# EAGLE design breakout0 (EAGLE 5.11)
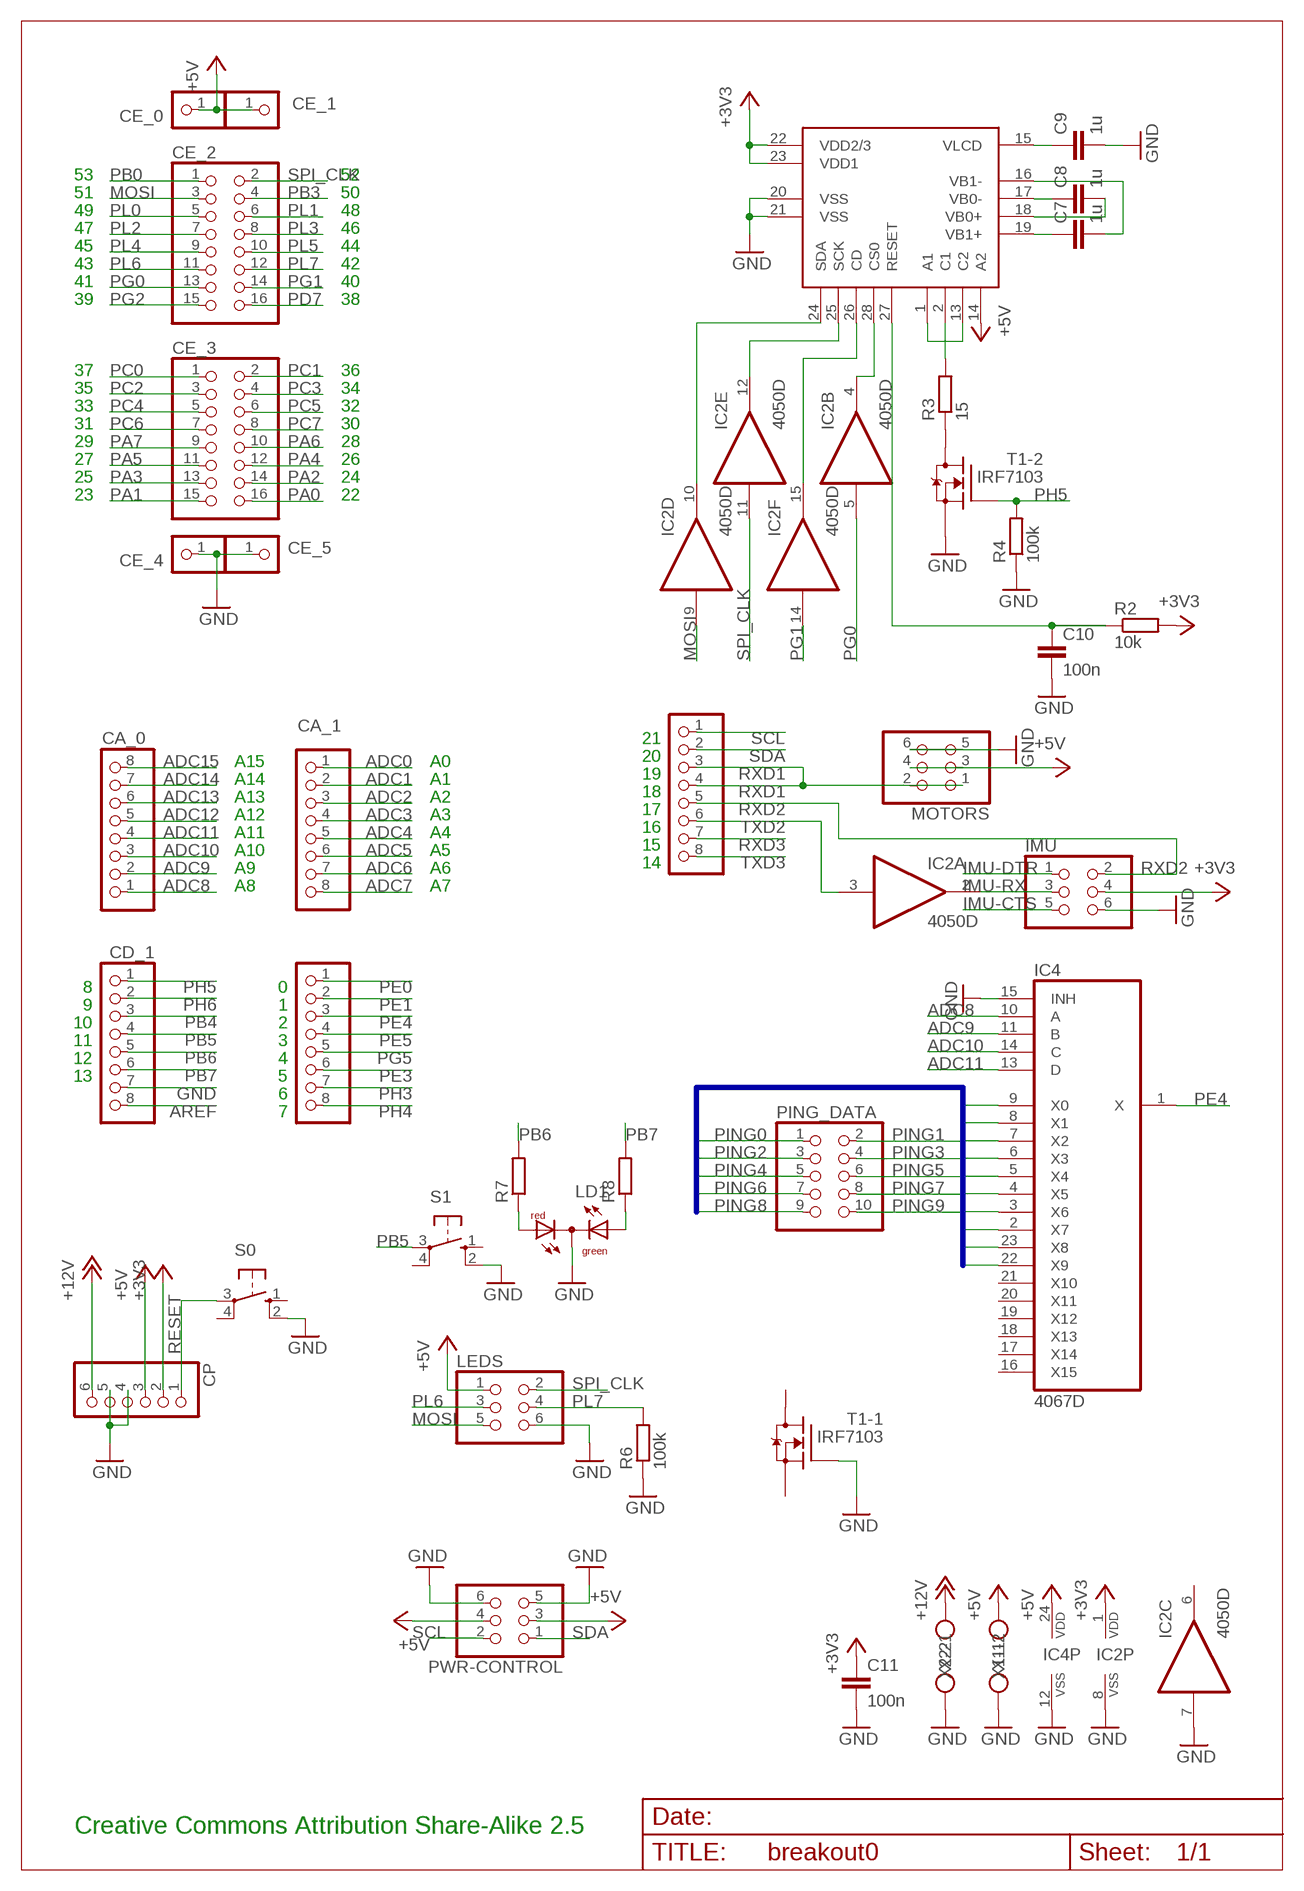
[diagram p0: schematic, sheet 1]

## Parts
C7  1u  C-EUC0805K  [C0805K]
C8  1u  C-EUC0805K  [C0805K]
C9  1u  C-EUC0805K  [C0805K]
C10  100n  C-EUC0805K  [C0805K]
C11  100n  C-EUC0805K  [C0805K]
CA_0  PINHD-1X8  [1X08]
CA_1  PINHD-1X8  [1X08]
CC  PINHD-1X8  [1X08]
CD_0  PINHD-1X8  [1X08]
CD_1  PINHD-1X8  [1X08]
CE_0  PINHD-1X1  [1X01]
CE_1  PINHD-1X1  [1X01]
CE_2  PINHD-2X8  [2X08]
CE_3  PINHD-2X8  [2X08]
CE_4  PINHD-1X1  [1X01]
CE_5  PINHD-1X1  [1X01]
CP  PINHD-1X6  [1X06]
IC2  4050D  [SO16]
IC3  DOGS 102  DOGS102  [DOGS102]
IC4  4067D  [SO24W]
IMU  PINHD-2X3  [2X03]
LD1  DUOLED-RG-C  [DUOLED-C-5MM]
LEDS  PINHD-2X3  [2X03]
MOTORS  PINHD-2X3  [2X03]
PING_DATA  PINHD-2X5  [2X05]
PWR-CONTROL  PINHD-2X3  [2X03]
R2  10k  R-EU_M0805  [M0805]
R3  15  R-EU_M0805  [M0805]
R4  100k  R-EU_M0805  [M0805]
R6  100k  R-EU_M0805  [M0805]
R7  R-EU_M0805  [M0805]
R8  R-EU_M0805  [M0805]
S0  10-XX  [B3F-10XX]
S1  10-XX  [B3F-10XX]
T1  IRF7103  [SO-8]
X1  MKDSN1,5/2-5,08  [MKDSN1,5/2-5,08]
X2  MKDSN1,5/2-5,08  [MKDSN1,5/2-5,08]

## Nets
+3V3: C11.1 CP.2 IC2.1(P:VDD) IC3.22(VDD2/3) IC3.23(VDD1) IMU.4 R2.2
+5V [power]: CE_0.1 CE_1.1 CP.3 IC3.14(A2) IC4.24(VDD) LEDS.1 MOTORS.3 MOTORS.4 PWR-CONTROL.3 PWR-CONTROL.4 X1.1
+12V: CP.6 X2.2
ADC0: CA_1.1
ADC1: CA_1.2
ADC2: CA_1.3
ADC3: CA_1.4
ADC4: CA_1.5
ADC5: CA_1.6
ADC6: CA_1.7
ADC7: CA_1.8
ADC8: CA_0.1 IC4.10(A)
ADC9: CA_0.2 IC4.11(B)
ADC10: CA_0.3 IC4.14(C)
ADC11: CA_0.4 IC4.13(D)
ADC12: CA_0.5
ADC13: CA_0.6
ADC14: CA_0.7
ADC15: CA_0.8
AREF: CD_1.8
GND [gnd]: C9.2 C10.2 C11.2 CD_1.7 CE_4.1 CE_5.1 CP.4 CP.5 IC2.7(C:I) IC2.8(P:VSS) IC3.20(VSS) IC3.21(VSS) IC4.12(VSS) IC4.15(INH) IMU.6 LD1.C LEDS.6 MOTORS.5 MOTORS.6 PWR-CONTROL.5 PWR-CONTROL.6 R4.1 R6.1 S0.2(S1) S1.2(S1) T1.2(-1:G) T1.3(-2:S) X1.2 X2.1
IMU-CTS: IMU.5
IMU-DTR: IMU.1
IMU-RX: IC2.2(A:O) IMU.3
LCD_CD: IC2.15(F:O) IC3.26(CD)
LCD_CS0: IC2.4(B:O) IC3.28(CS0)
LCD_RESET: C10.1 IC3.27(RESET) R2.1
LCD_SCK: IC2.12(E:O) IC3.25(SCK)
LCD_SDA: IC2.10(D:O) IC3.24(SDA)
MOSI: CE_2.3 IC2.9(D:I) LEDS.5
N$1: R3.1 T1.5(-2:D1)
N$4: LD1.AR R7.1
N$5: LD1.AX(AG) R8.1
N$13: IC3.1(A1) IC3.13(C2)
N$14: IC3.2(C1) R3.2
N$17: C8.1 IC3.17(VB0-)
N$18: C8.2 IC3.18(VB0+)
N$19: C7.1 IC3.19(VB1+)
N$20: C7.2 IC3.16(VB1-)
N$21: C9.1 IC3.15(VLCD)
PA0: CE_3.16
PA1: CE_3.15
PA2: CE_3.14
PA3: CE_3.13
PA4: CE_3.12
PA5: CE_3.11
PA6: CE_3.10
PA7: CE_3.9
PB0: CE_2.1
PB3: CE_2.4
PB4: CD_1.3
PB5: CD_1.4 S1.3(P)
PB6: CD_1.5 R7.2
PB7: CD_1.6 R8.2
PC0: CE_3.1
PC1: CE_3.2
PC2: CE_3.3
PC3: CE_3.4
PC4: CE_3.5
PC5: CE_3.6
PC6: CE_3.7
PC7: CE_3.8
PD7: CE_2.16
PE0: CD_0.1
PE1: CD_0.2
PE3: CD_0.6
PE4: CD_0.3 IC4.1(X)
PE5: CD_0.4
PG0: CE_2.13 IC2.5(B:I)
PG1: CE_2.14 IC2.14(F:I)
PG2: CE_2.15
PG5: CD_0.5
PH3: CD_0.7
PH4: CD_0.8
PH5: CD_1.1 R4.2 T1.4(-2:G)
PH6: CD_1.2
PING0: IC4.9(X0) PING_DATA.1
PING1: IC4.8(X1) PING_DATA.2
PING2: IC4.7(X2) PING_DATA.3
PING3: IC4.6(X3) PING_DATA.4
PING4: IC4.5(X4) PING_DATA.5
PING5: IC4.4(X5) PING_DATA.6
PING6: IC4.3(X6) PING_DATA.7
PING7: IC4.2(X7) PING_DATA.8
PING8: IC4.23(X8) PING_DATA.9
PING9: IC4.22(X9) PING_DATA.10
PL0: CE_2.5
PL1: CE_2.6
PL2: CE_2.7
PL3: CE_2.8
PL4: CE_2.9
PL5: CE_2.10
PL6: CE_2.11 LEDS.3
PL7: CE_2.12 LEDS.4 R6.2
RESET: CP.1 S0.3(P)
RXD1: CC.3 CC.4 MOTORS.1 MOTORS.2
RXD2: CC.5 IMU.2
RXD3: CC.7
SCL: CC.1 PWR-CONTROL.2
SDA: CC.2 PWR-CONTROL.1
SPI_CLK: CE_2.2 IC2.11(E:I) LEDS.2
TXD2: CC.6 IC2.3(A:I)
TXD3: CC.8
Unconnected: IC2.6(C:O) IC4.16(X15) IC4.17(X14) IC4.18(X13) IC4.19(X12) IC4.20(X11) IC4.21(X10) S0.1(S) S0.4(P1) S1.1(S) S1.4(P1) T1.1(-1:S) T1.6(-2:D) T1.7(-1:D1) T1.8(-1:D)

## Buses
PING[0..9]

## Notes on the sheet
- 53 | 52
- 51 | 50
- 49 | 48
- 47 | 46
- 45 | 44
- 43 | 42
- 41 | 40
- 39 | 38
- 37 | 36
- 35 | 34
- 33 | 32
- 31 | 30
- 29 | 28
- 27 | 26
- 25 | 24
- 23 | 22
- 21
- 20
- A15 | A0 | 19
- A14 | A1 | 18
- A13 | A2 | 17
- A12 | A3 | 16
- A11 | A4 | 15
- A10 | A5 | 14
- A9 | A6
- A8 | A7
- 8 | 0
- 9 | 1
- 10 | 2
- 11 | 3
- 12 | 4
- 13 | 5
- 6
- 7
- Creative Commons Attribution Share-Alike 2.5

## Library data of the parts
C7-C11 = rcl:C-EU: CAPACITOR, European symbol
CA_0 CA_1 CC CD_0 CD_1 = pinhead:PINHD-1X8: PIN HEADER
CE_0 CE_1 CE_4 CE_5 = pinhead:PINHD-1X1: PIN HEADER
CE_2 CE_3 = pinhead:PINHD-2X8: PIN HEADER
CP = pinhead:PINHD-1X6: PIN HEADER
IC2 = 40xx:4050: Hex non-inverting BUFFER
IC3 = DOGS102:DOGS102: DOGS102-6 GRAFIK 102x64 39x41 mm LED-BELEUCHTUNG WEISS, EA LED39X41-W LED-BELEUCHTUNG AMBER, EA LED39X41-A LED-BELEUCHTUNG GR/ROT , EA LED39X41-GR
IC4 = 40xx:4067: 16-channel ANALOG MULTIPLEXER
IMU LEDS MOTORS PWR-CONTROL = pinhead:PINHD-2X3: PIN HEADER
LD1 = led:DUOLED-RG-C: DUO LED 2 colors (red/green), 5 mm, round, common Cathode www.ligitek.com or other producers.
PING_DATA = pinhead:PINHD-2X5: PIN HEADER
R2 R3 R7 R8 = rcl:R-EU_: RESISTOR, European symbol
R4 R6 = resistor:R-EU_: RESISTOR, European symbol
S0 S1 = switch-omron:10-XX: OMRON SWITCH
T1 = transistor-fet:IRF7103: Dual N-Channel MOSFET
X1 X2 = con-phoenix-508:MKDSN1,5/2-5,08: MKDSN 1,5/ 2-5,08 Printklemme Nennstrom: 13,5 A Nennspannung: 250 V Rastermaß: 5,08 mm Polzahl: 2 Anschlussart: Schraubanschluss Montage: Löten Anschlussrichtung Leiter/Platine: 0 ° Artikelnummer: 1729128 Source: http://eshop.phoenixcontact.com .. 1729128.pdf

## Net classes
0 default: width 0.203 mm, drill 0.406 mm, clearance 0.203 mm
1 power: width 0.61 mm, drill 0.711 mm, clearance 0.203 mm
2 gnd: width 0.305 mm, drill 0.711 mm, clearance 0.203 mm
3 usbvcc: width 0.508 mm, drill 0.711 mm, clearance 0.203 mm

## Board
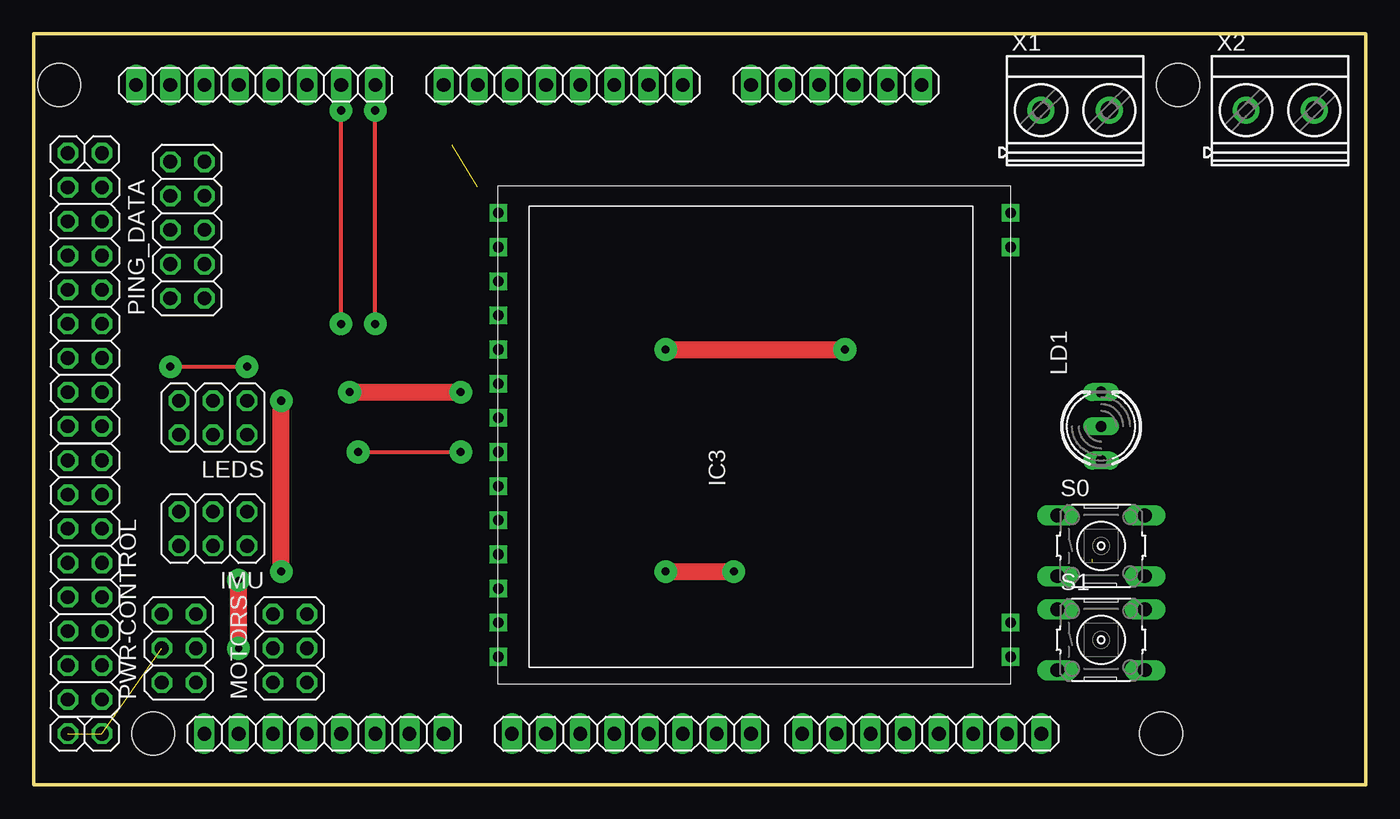
[diagram p1: board, top side]
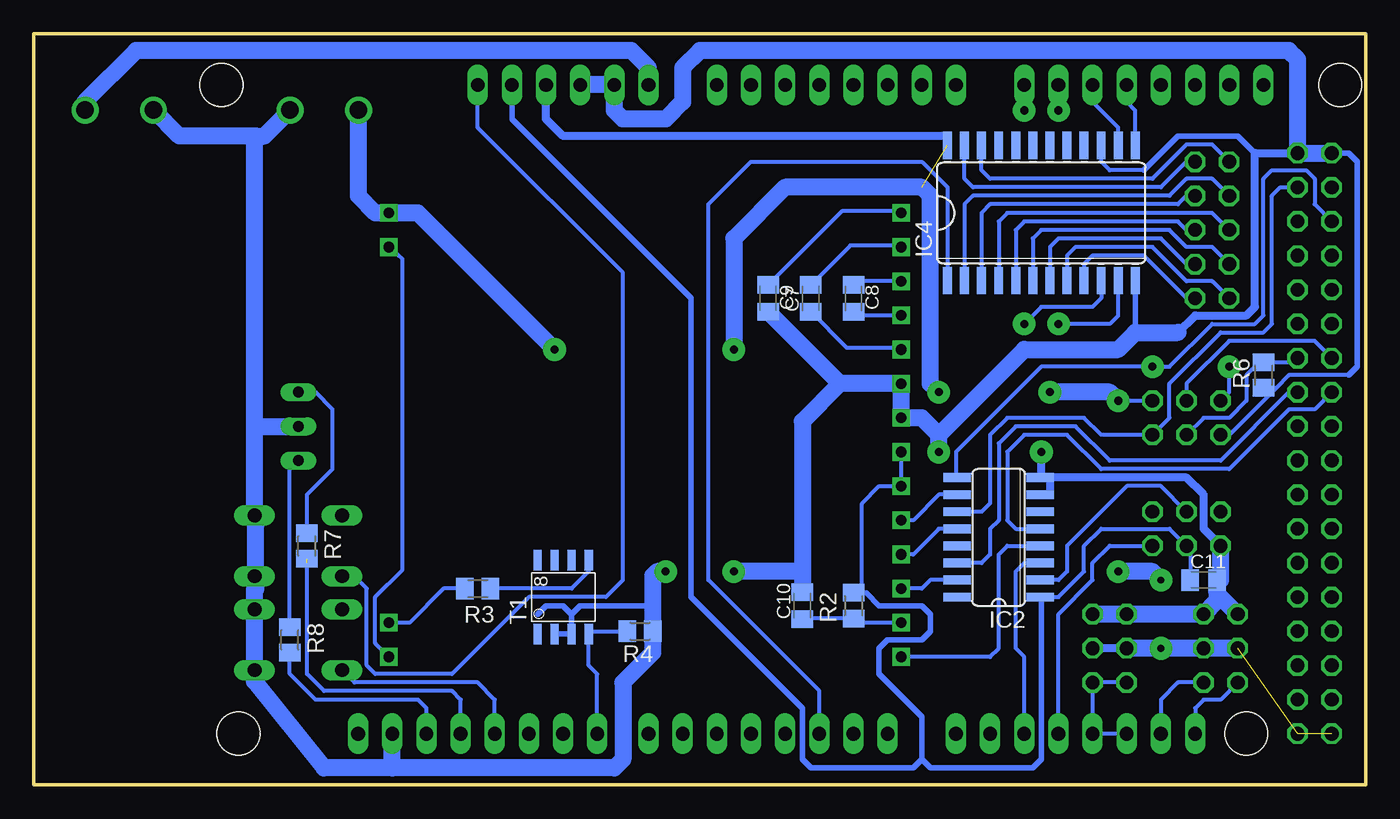
[diagram p2: board, bottom side, seen from below]

Size 99.06 x 55.88 mm. Coordinates in mm from the lower left corner, seen from the top.
Outline: 99.06,0 0,0 0,55.88 99.06,55.88 99.06,0
Copper layers (1*16): Top 0.035mm / dielectric 1.5mm / Bottom 0.035mm
Design rules "default *": minimum track width 8mil, minimum drill 16mil, track to track 8mil, track to pad 8mil, pad to pad 8mil, via to via 10mil, smd to smd 8mil, copper to edge 40mil, drill to drill 12mil, minimum pad ring 10mil, minimum via ring 10mil, stop-mask expansion 4mil, vias tented up to drill 0mil, thermal gap 10mil
Holes 3.2 mm at 85.09,52.07 83.82,3.81 8.89,3.81 1.91,52.07
bKeepout: area 85.7,1.9 to 99.1,21.6

### Footprints (pad centres in the part's own frame; a part is rotated, then mirrored left to right if it is on the bottom)
C0805K = smd 1.3 x 1.6: 1 -1,0; 2 1,0
1X08 = drill 1.016 long: 1 -8.89,0; 2 -6.35,0; 3 -3.81,0; 4 -1.27,0; 5 1.27,0; 6 3.81,0; 7 6.35,0; 8 8.89,0
1X01 = drill 1.016 octagon: 1 0,0
2X08 = drill 1.016 octagon: 1 -8.89,-1.27; 2 -8.89,1.27; 3 -6.35,-1.27; 4 -6.35,1.27; 5 -3.81,-1.27; 6 -3.81,1.27; 7 -1.27,-1.27; 8 -1.27,1.27; 9 1.27,-1.27; 10 1.27,1.27; 11 3.81,-1.27; 12 3.81,1.27; 13 6.35,-1.27; 14 6.35,1.27; 15 8.89,-1.27; 16 8.89,1.27
1X06 = drill 1.016 long: 1 -6.35,0; 2 -3.81,0; 3 -1.27,0; 4 1.27,0; 5 3.81,0; 6 6.35,0
SO16 = smd 0.66 x 2.032: 1 -4.445,-3.073; 2 -3.175,-3.073; 3 -1.905,-3.073; 4 -0.635,-3.073; 5 0.635,-3.073; 6 1.905,-3.073; 7 3.175,-3.073; 8 4.445,-3.073; 9 4.445,3.073; 10 3.175,3.073; 11 1.905,3.073; 12 0.635,3.073; 13 -0.635,3.073; 14 -1.905,3.073; 15 -3.175,3.073; 16 -4.445,3.073
DOGS102 = drill 0.8 square: 1 -17.018,-19.304; 2 -14.478,-19.304; 13 13.462,-19.304; 14 16.002,-19.304; 15 16.002,18.796; 16 13.462,18.796; 17 10.922,18.796; 18 8.382,18.796; 19 5.842,18.796; 20 3.302,18.796; 21 0.762,18.796; 22 -1.778,18.796; 23 -4.318,18.796; 24 -6.858,18.796; 25 -9.398,18.796; 26 -11.938,18.796; 27 -14.478,18.796; 28 -17.018,18.796
SO24W = smd 0.66 x 2.032: 1 -6.985,-5.029; 2 -5.715,-5.029; 3 -4.445,-5.029; 4 -3.175,-5.029; 5 -1.905,-5.029; 6 -0.635,-5.029; 7 0.635,-5.029; 8 1.905,-5.029; 9 3.175,-5.029; 10 4.445,-5.029; 11 5.715,-5.029; 12 6.985,-5.029; 13 6.985,5.029; 14 5.715,5.029; 15 4.445,5.029; 16 3.175,5.029; 17 1.905,5.029; 18 0.635,5.029; 19 -0.635,5.029; 20 -1.905,5.029; 21 -3.175,5.029; 22 -4.445,5.029; 23 -5.715,5.029; 24 -6.985,5.029
2X03 = drill 1.016 octagon: 1 -2.54,-1.27; 2 -2.54,1.27; 3 0,-1.27; 4 0,1.27; 5 2.54,-1.27; 6 2.54,1.27
DUOLED-C-5MM = drill 0.813 long: AR 2.54,0; AX -2.54,0; C 0,0
2X05 = drill 1.016 octagon: 1 -5.08,-1.27; 2 -5.08,1.27; 3 -2.54,-1.27; 4 -2.54,1.27; 5 0,-1.27; 6 0,1.27; 7 2.54,-1.27; 8 2.54,1.27; 9 5.08,-1.27; 10 5.08,1.27
M0805 = smd 1.3 x 1.6: 1 -0.95,0; 2 0.95,0
B3F-10XX = drill 1.016 long: 1 -3.251,2.261; 2 3.251,2.261; 3 -3.251,-2.261; 4 3.251,-2.261
SO-8 = smd 1.524 x 0.61: 1 -2.743,1.905; 2 -2.743,0.635; 3 -2.743,-0.635; 4 -2.743,-1.905; 5 2.743,-1.905; 6 2.743,-0.635; 7 2.743,0.635; 8 2.743,1.905
MKDSN1,5/2-5,08 = drill 1.3 pad 2 round: 1 -2.561,0.025; 2 2.519,0.025

### Placement (x,y rotation side)
C7  41.27,36.2 90 bottom
C8  38.1,36.2 270 bottom
C9  44.45,36.2 270 bottom
C10  41.91,13.34 90 bottom
C11  12.06,15.24 0 bottom
CA_0  16.51,52.07 180 top
CA_1  39.37,52.07 180 top
CC  21.59,3.81 0 top
CD_0  44.45,3.81 0 top
CD_1  66.04,3.81 0 top
CE_0  2.54,3.81 180 top
CE_1  5.08,3.81 180 top
CE_2  3.81,35.56 270 top
CE_3  3.81,15.24 270 top
CE_4  2.54,46.99 180 top
CE_5  5.08,46.99 180 top
CP  59.69,52.07 180 top
IC2  27.3,18.41 90 bottom
IC3  53.34,26.54 90 top
IC4  24.13,42.55 0 bottom
IMU  13.34,19.05 180 top
LD1  79.38,26.67 90 top
LEDS  13.34,27.3 180 top
MOTORS  19.05,10.16 90 top
PING_DATA  11.43,41.27 90 top
PWR-CONTROL  10.79,10.16 90 top
R2  38.1,13.34 90 bottom
R3  66.04,14.61 180 bottom
R4  53.98,11.43 180 bottom
R6  7.62,30.48 90 bottom
R7  78.74,17.78 270 bottom
R8  80.01,10.79 270 bottom
S0  79.38,17.78 0 top
S1  79.38,10.79 0 top
T1  59.69,13.97 90 bottom
X1  77.47,50.16 0 top
X2  92.71,50.16 0 top

### Tracks (layer width: path | path; a pad name or v marks a point on that pad's centre or on a via)
+3V3
  Bottom 0.305: IC3.22 IC3.23 36.2,22.23 37.47,20.95 37.47,14.29 | C11.1 13.06,17.51 IMU.4 14.61,19.05 19.68,19.05 20.95,17.78 20.95,15.88 22.86,13.97 IC2.1 24.13,13.87 | 37.15,14.29 37.47,14.29 | 37.47,14.29 R2.2
  Bottom 0.406: CP.2 63.5,49.53 50.16,36.2 50.16,13.97 41.91,5.71 41.91,1.91 41.27,1.27 33.66,1.27 33.02,1.91 | 37.15,14.29 36.2,13.34 33.02,13.34 32.38,12.7 32.38,11.43 33.02,10.79 35.56,10.79 36.2,10.16 36.2,8.26 33.02,5.08 33.02,1.91 | 24.13,13.87 24.13,1.91 24.77,1.27 32.38,1.27 33.02,1.91
+5V  (via drill 0.5 pad 1.68, 0.6 pad 1.68)  (3 unrouted)
  Top 1.27: v23.5,29.21 v31.75,29.21 | v46.99,32.38 v60.33,32.38 | v18.41,15.88 v18.41,28.57 | v15.24,10.16 v15.24,15.24
  Bottom 0.305: LEDS.1 v18.41,28.57 19.05,28.57
  Bottom 0.406: IC4.24 31.11,48.26
  Bottom 0.61: MOTORS.4 MOTORS.3 | 31.11,48.26 59.69,48.26 60.96,49.53 CP.3
  Bottom 1.27: v23.5,29.21 19.05,29.21 v18.41,28.57 | v31.75,29.21 32.38,29.84 32.38,43.81 33.02,44.45 43.18,44.45 46.99,40.64 v46.99,32.38 | v60.33,32.38 70.48,42.55 IC3.14 73.66,42.55 74.91,43.79 X1.1 | PWR-CONTROL.4 PWR-CONTROL.3 v15.24,10.16 MOTORS.4 | v18.41,15.88 15.88,15.88 v15.24,15.24
+12V
  Bottom 1.27: CP.6 53.34,53.34 54.61,54.61 91.44,54.61 95.25,50.8 95.25,50.21 X2.2
ADC8  (via drill 0.6 pad 1.68)
  Top 0.305: v25.4,34.29 v25.4,50.16
  Bottom 0.305: v25.4,50.16 CA_0.1 | v25.4,34.29 24.13,35.56 20.32,35.56 19.68,36.2 IC4.10
ADC9  (via drill 0.6 pad 1.68)
  Top 0.305: v22.86,34.29 v22.86,50.16
  Bottom 0.305: v22.86,50.16 CA_0.2 | v22.86,34.29 19.05,34.29 18.41,34.92 IC4.11
ADC10
  Bottom 0.305: CA_0.3 20.32,50.8 18.41,48.9 IC4.14
ADC11
  Bottom 0.305: IC4.13 17.14,50.16 17.78,50.8 CA_0.4
GND  (via drill 0.6 pad 1.68)
  Top 0.305: v24.13,24.77 v31.75,24.77
  Top 1.27: v46.99,15.88 v52.07,15.88
  Bottom 0.305: 16.51,45.72 19.05,45.72 19.68,46.35 IC4.15 | LEDS.6 10.16,26.04 6.67,29.53 | 6.67,29.53 5.71,30.48 1.27,30.48 | R6.1 6.67,29.53
  Bottom 0.406: 59.05,12.7 T1.3 T1.2 | 59.05,12.7 59.69,13.34 60.96,13.34 61.59,12.7 | 1.27,30.48 0.64,31.11 0.64,46.35 1.27,46.99 CE_4.1 | 59.05,12.7 58.42,13.34 53.02,13.34 | 17.14,33.66 IC4.12 | 16.51,45.72 13.97,48.26 9.53,48.26 8.26,46.99
  Bottom 0.61: R4.1 53.34,11.12 | 13.97,33.66 12.7,34.92 8.89,34.92 8.26,35.56 8.26,46.99 CE_5.1 | IMU.6 12.06,19.05 12.06,21.59 13.34,22.86 23.5,22.86 | 23.5,22.86 IC2.8 24.13,22.96 v24.13,24.77 | IC2.7 23.5,21.59 23.5,22.86
  Bottom 1.27: 72.39,1.27 55.88,1.27 55.24,1.91 55.24,7.62 53.02,9.84 R4.1 53.02,13.34 53.02,15.55 52.7,15.88 v52.07,15.88 | 72.39,1.27 CD_1.7 | 41.91,15.88 v46.99,15.88 | 41.91,15.88 C10.2 | 39.1,29.84 C9.2 | 39.1,29.84 IC3.20 IC3.21 33.02,27.3 31.75,26.04 | 41.91,15.88 41.91,27.04 39.1,29.84 | 31.75,26.04 25.4,32.38 18.41,32.38 17.14,33.66 13.97,33.66 | v31.75,24.77 31.75,26.04 | CE_4.1 CE_5.1 5.08,53.98 5.71,54.61 49.53,54.61 50.8,53.34 50.8,50.8 52.07,49.53 55.24,49.53 55.88,50.16 CP.5 CP.4 | MOTORS.5 MOTORS.6 PWR-CONTROL.5 11.06,13.7 11.06,14.24 | IMU.6 10.79,15.24 C11.2 11.06,14.24 | 72.39,1.27 77.47,1.27 82.63,7.7 S1.2 82.63,14.53 82.55,14.61 82.55,19.33 S0.2 82.63,26.67 | X1.2 81.92,48.26 82.55,48.26 | 82.55,48.26 88.22,48.26 X2.1 | 82.63,26.67 82.63,48.18 82.55,48.26 | 82.63,26.67 LD1.C | PWR-CONTROL.6 11.06,14.24
IMU-RX
  Bottom 0.305: IMU.3 15.24,22.23 17.78,22.23 22.23,17.78 22.23,15.88 22.86,15.24 IC2.2
LCD_CD
  Bottom 0.305: IC2.15 32.38,15.24 33.02,14.61 IC3.26
LCD_CS0
  Bottom 0.305: IC2.4 26.67,17.78 27.3,17.14 27.3,10.16 27.94,9.53 IC3.28
LCD_RESET
  Bottom 0.305: IC3.27 37.47,12.06 R2.1 41.23,12.38 C10.1
LCD_SCK
  Bottom 0.305: IC2.12 31.75,19.05 33.66,17.14 IC3.25
LCD_SDA
  Bottom 0.305: IC2.10 31.75,21.59 33.66,19.68 IC3.24
MOSI  (via drill 0.6 pad 1.68)
  Top 0.305: v10.16,31.11 v15.88,31.11
  Bottom 0.305: CE_2.3 3.81,43.18 3.81,45.09 4.45,45.72 6.99,45.72 7.62,45.09 7.62,34.92 8.26,34.29 11.43,34.29 14.61,31.11 v15.88,31.11 24.13,31.11 30.48,24.77 30.48,22.96 IC2.9 30.38,22.96 | v10.16,31.11 10.16,29.21 LEDS.5
N$1
  Bottom 0.305: T1.5 57.78,15.88 59.05,14.61 R3.1
N$4
  Bottom 0.305: R7.1 78.74,21.59 76.83,23.5 76.83,27.94 78.11,29.21 LD1.AR
N$5
  Bottom 0.305: R8.1 80.01,23.5 LD1.AX
N$13
  Bottom 0.305: IC3.13 71.63,39.12 71.63,16 73.66,13.97 73.66,10.54 IC3.1
N$14
  Bottom 0.305: R3.2 68.58,14.61 71.12,12.06 IC3.2
N$17
  Bottom 0.305: IC3.17 37.83,37.47 C8.1
N$18
  Bottom 0.305: IC3.18 37.83,34.92 C8.2
N$19
  Bottom 0.305: C7.1 38.59,32.51 34.67,32.51 IC3.19
N$20
  Bottom 0.305: C7.2 38.34,40.13 34.67,40.13 IC3.16
N$21
  Bottom 0.305: 44.45,37.47 C9.1 38.97,42.67 34.67,42.67 IC3.15
PB5
  Bottom 0.305: CD_1.4 64.77,6.35 66.04,7.62 75.21,7.62 S1.3
PB6  (1 unrouted)
  Bottom 0.305: CD_1.5 67.31,6.35 67.94,6.99 77.47,6.99 78.74,8.26 78.74,16.51
PB7
  Bottom 0.305: CD_1.6 69.85,5.71 70.48,6.35 78.11,6.35 80.01,8.26 R8.2
PE4
  Bottom 0.305: CD_0.3 40.64,6.99 48.9,15.24 48.9,43.18 45.72,46.35 33.02,46.35 31.11,44.45 IC4.1
PG0
  Bottom 0.305: IC2.5 26.04,19.05 26.67,19.68 26.67,24.77 25.4,26.04 22.23,26.04 19.68,23.5 10.16,23.5 5.71,27.94 3.81,27.94 CE_2.13
PG1
  Bottom 0.305: IC2.14 28.57,16.51 27.94,17.14 27.94,19.05 27.3,19.68 27.3,25.4 26.04,26.67 21.59,26.67 19.05,24.13 10.79,24.13 5.71,29.21 CE_2.14
PH5
  Bottom 0.305: 57.78,10.79 T1.4 57.58,11.43 | 57.58,11.43 R4.2 | 57.58,11.43 57.78,11.43 57.78,8.89 57.15,8.26 CD_1.1
PING0
  Bottom 0.305: PING_DATA.1 13.34,36.2 16.51,39.37 20.32,39.37 20.95,38.73 IC4.9
PING1
  Bottom 0.305: PING_DATA.2 11.43,37.47 13.34,37.47 15.88,40.01 21.59,40.01 22.23,39.37 IC4.8
PING2
  Bottom 0.305: PING_DATA.3 13.34,38.73 15.24,40.64 22.86,40.64 23.5,40.01 IC4.7
PING3
  Bottom 0.305: PING_DATA.4 11.43,40.01 13.34,40.01 14.61,41.27 24.13,41.27 24.77,40.64 IC4.6
PING4
  Bottom 0.305: PING_DATA.5 13.34,41.27 13.97,41.91 25.4,41.91 26.04,41.27 IC4.5
PING5
  Bottom 0.305: PING_DATA.6 11.43,42.55 26.67,42.55 27.3,41.91 IC4.4
PING6
  Bottom 0.305: PING_DATA.7 13.34,43.81 13.97,43.18 27.94,43.18 28.57,42.55 IC4.3
PING7
  Bottom 0.305: PING_DATA.8 11.43,45.09 13.34,45.09 14.61,43.81 29.21,43.81 29.84,43.18 IC4.2
PING8
  Bottom 0.305: PING_DATA.9 13.34,46.35 15.24,44.45 29.21,44.45 29.84,45.09 IC4.23
PING9
  Bottom 0.305: PING_DATA.10 11.43,47.62 13.34,47.62 15.88,45.09 27.94,45.09 28.57,45.72 IC4.22
PL6
  Bottom 0.305: CE_2.11 3.81,33.02 10.16,33.02 13.34,29.84 LEDS.3
PL7
  Bottom 0.305: LEDS.4 12.06,27.3 10.16,27.3 8.89,28.57 8.89,30.48 7.94,31.43 R6.2 5.4,31.43 CE_2.12
RESET
  Bottom 0.305: CP.1 66.04,48.9 55.24,38.1 55.24,15.24 56.52,13.97 62.23,13.97 67.94,8.26 73.66,8.26 74.3,8.89 74.3,14.61 74.93,15.24 75.21,15.24 S0.3
RXD1
  Bottom 0.305: CC.3 CC.4 MOTORS.1 MOTORS.2
RXD2
  Bottom 0.305: IMU.2 19.05,17.78 20.32,16.51 20.32,15.24 22.86,12.7 CC.5
SCL
  Bottom 0.305: PWR-CONTROL.2 10.79,6.35 12.06,6.35 12.7,5.71 CC.1
SDA
  Bottom 0.305: PWR-CONTROL.1 13.97,7.62 15.24,6.35 CC.2
SPI_CLK
  Bottom 0.305: CE_2.2 6.35,44.45 6.99,43.81 6.99,34.29 7.62,33.66 10.79,33.66 14.61,29.84 14.61,27.3 LEDS.2 19.68,26.04 20.95,27.3 26.67,27.3 27.94,26.04 27.94,20.95 28.57,20.32 IC2.11
TXD2
  Bottom 0.305: IC2.3 25.4,16.51 26.04,15.88 26.04,10.16 25.4,9.53 CC.6